# Altium schematic sheet Power.SchDoc
size A4
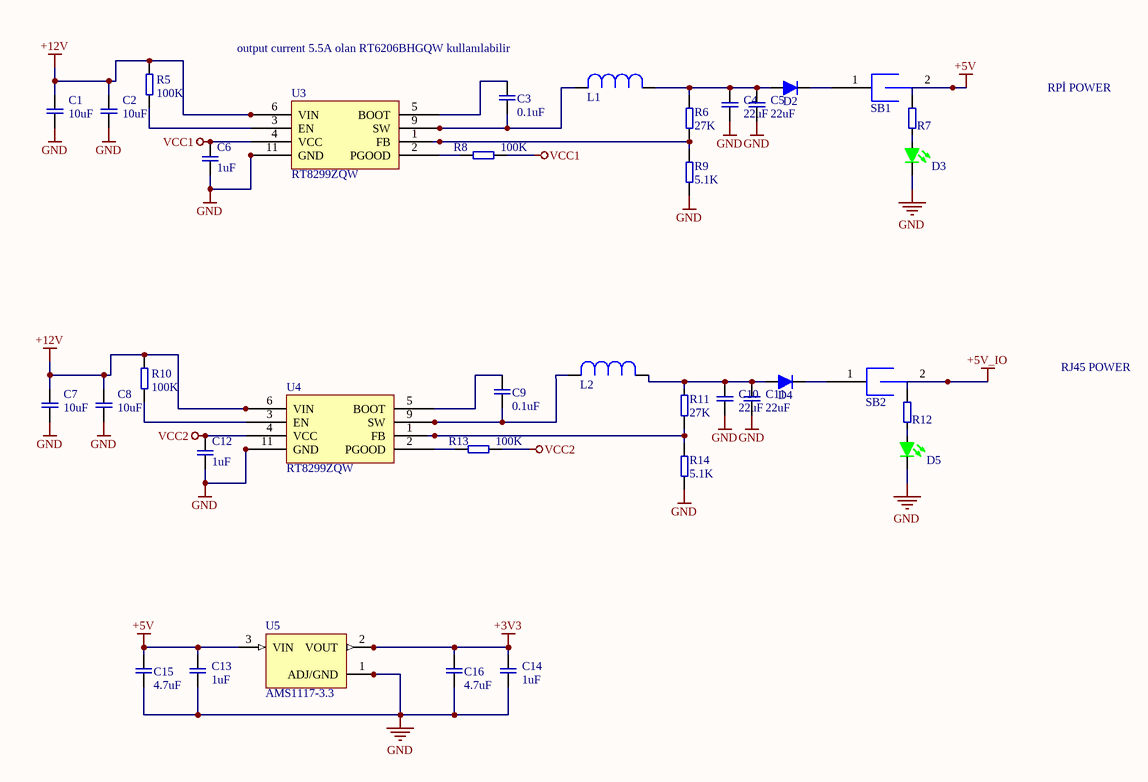
[diagram p0: Power.SchDoc]

## Parts
C1  10uF  [C0805]
C2  10uF  [C0805]
C3  0.1uF  [C0402]
C4  22uF  [C1210]
C5  22uF  [C1210]
C6  1uF  [C0603]
C7  10uF  [C0805]
C8  10uF  [C0805]
C9  0.1uF  [C0402]
C10  22uF  [C1210]
C11  22uF  [C1210]
C12  1uF  [C0603]
C13  1uF  [C0402]
C14  1uF  [C0402]
C15  4.7uF  [C0402]
C16  4.7uF  [C0402]
D2  TSSA3U60 R3G  [TAIWAN_TSSA3U60 R3G]  (value not drawn)
D3  SML-LX0603GW-TR  [L0603]  (value not drawn)
D4  TSSA3U60 R3G  [TAIWAN_TSSA3U60 R3G]  (value not drawn)
D5  SML-LX0603GW-TR  [L0603]  (value not drawn)
L1  XAL6060-682MEB  [CC_XAL6060-682MEB]  (value not drawn)
L2  XAL6060-682MEB  [CC_XAL6060-682MEB]  (value not drawn)
R5  100K  [R0402]
R6  27K  [R0402]
R7  330R  [R0603]  (value not drawn)
R8  100K  [R0402]
R9  5.1K  [R0402]
R10  100K  [R0402]
R11  27K  [R0402]
R12  330R  [R0603]  (value not drawn)
R13  100K  [R0402]
R14  5.1K  [R0402]
SB1  Jumper  [SB.0805]  (value not drawn)
SB2  Jumper  [SB.0805]  (value not drawn)
U3  RT8299ZQW  [RT8299ZQW]
U4  RT8299ZQW  [RT8299ZQW]
U5  AMS1117-3.3  [AMS1117-3.3]

## Nets
+3V3: C14.2 C16.2 U5.2(VOUT)
+5V: C13.2 C15.2 R7.2 SB1.2 U5.3(VIN)
+5V_IO: R12.2 SB2.2
+12V: C1.1 C2.1 C7.1 C8.1 R5.2 R10.2 U3.6(VIN) U3.7(VIN) U4.6(VIN) U4.7(VIN)
GND: C1.2 C2.2 C4.1 C5.1 C6.1 C7.2 C8.2 C10.1 C11.1 C12.1 C13.1 C14.1 C15.1 C16.1 D3.C D5.C R9.2 R14.2 U3.10(GND) U3.11(GND) U4.10(GND) U4.11(GND) U5.1(ADJ/GND)
VCC1: C6.2 R8.1 U3.4(VCC)
VCC2: C12.2 R13.1 U4.4(VCC)
NetC3_1: C3.1 L1.2 U3.8(SW) U3.9(SW)
NetC3_2: C3.2 U3.5(BOOT)
NetC4_2: C4.2 C5.2 D2.A L1.1 R6.2
NetC9_1: C9.1 L2.2 U4.8(SW) U4.9(SW)
NetC9_2: C9.2 U4.5(BOOT)
NetC10_2: C10.2 C11.2 D4.A L2.1 R11.2
NetD2_C: D2.C SB1.1
NetD3_A: D3.A R7.1
NetD4_C: D4.C SB2.1
NetD5_A: D5.A R12.1
NetR5_1: R5.1 U3.3(EN)
NetR6_1: R6.1 R9.1 U3.1(FB)
NetR8_2: R8.2 U3.2(PGOOD)
NetR10_1: R10.1 U4.3(EN)
NetR11_1: R11.1 R14.1 U4.1(FB)
NetR13_2: R13.2 U4.2(PGOOD)

## Notes on the sheet
- output current 5.5A olan RT6206BHGQW kullanılabilir
- RPİ POWER
- RJ45 POWER

## Library data of the parts
C1 C2 C7 C8 = CC0805KKX5R8BB106: CAP CER 10UF 25V X5R 0805; Manufacturer: YAGEO; Que: 074; Tolerance: ±10%; Type: Ceramic; Name: Recep Aydin; Part Number: CC0805KKX5R8BB106; Voltage: 25V; Temperature Coefficient: X5R; Package: 0805(2012 Metric); Datasheet: https://www.yageo.com/upload/media/product/productsearch/datasheet/mlcc/UPY-GPHC_X5R_4V-to-50V_26.pdf; Manufacturer Part Number: CC0805KKX5R8BB106
C3 C9 = 04023C104KAT2A: CAP CER 0.1UF 25V X7R 0402; Manufacturer: AVX Corporation; Que: 009; Tolerance: ±10%; Type: Ceramic; Name: Recep Aydin; Part Number: 04023C104KAT2A; Voltage: 25V; Temperature Coefficient: X7R; Package: 0402(1005 Metric); Datasheet: https://datasheets.avx.com/X7RDielectric.pdf; Manufacturer Part Number: 04023C104KAT2A
C4 C5 C10 C11 = CL32A226KAJNNWE: CAP CER 22UF 25V X5R 1210; Manufacturer: Samsung Electro-Mechanics; Que: 018; Tolerance: ±10%; Type: Ceramic; Name: Recep Aydin; Part Number: CL32A226KAJNNWE; Voltage: 25V; Temperature Coefficient: X5R; Package: 1210(3225 Metric); Datasheet: https://www.samsungsem.com/kr/support/product-search/mlcc/CL32A226KAJNNWE.jsp; Manufacturer Part Number: CL32A226KAJNNWE
C6 C12 = CGA3E1X7R1E105M080AC: CAP CER 1UF 25V X7R 0603; Manufacturer: TDK Corporation; Que: 017; Tolerance: ±20%; Type: Ceramic; Name: Recep Aydin; Part Number: CGA3E1X7R1E105M080AC; Voltage: 25V; Temperature Coefficient: X7R; Package: 0603(1608 Metric); Datasheet: https://product.tdk.com/en/system/files?file=dam/doc/product/capacitor/ceramic/mlcc/catalog/mlcc_automotive_general_en.pdf; Manufacturer Part Number: CGA3E1X7R1E105M080AC
C13 C14 = CL05A105KO5NNNC: CAP CER 1UF 16V X5R 0402; Manufacturer: Samsung Electro-Mechanics; Que: 077; Tolerance: ±10%; Type: Ceramic; Name: Recep Aydin; Part Number: CL05A105KO5NNNC; Voltage: 16V; Temperature Coefficient: X5R; Package: 0402(1005 Metric); Datasheet: https://media.digikey.com/pdf/Data%20Sheets/Samsung%20PDFs/CL05A105KO5NNNC_Spec_5-2-19.pdf; Manufacturer Part Number: CL05A105KO5NNNC
C15 C16 = C1005X5R1A475K050BC: CAP CER 4.7UF 10V X5R 0402; Manufacturer: TDK Corporation; Que: 021; Tolerance: ±10%; Type: Ceramic; Name: Recep Aydin; Part Number: C1005X5R1A475K050BC; Voltage: 10V; Temperature Coefficient: X5R; Package: 0402(1005 Metric); Datasheet: https://product.tdk.com/en/system/files?file=dam/doc/product/capacitor/ceramic/mlcc/catalog/mlcc_commercial_general_en.pdf; Manufacturer Part Number: C1005X5R1A475K050BC
D2 D4 = TSSA3U60 R3G: DIODE SCHOTTKY 60V 3A DO214AC; Manufacturer: Taiwan Semiconductor Corporation; Que: 003; Speed: Fast Recovery =< 500ns, > 200mA (Io); Name: Recep Aydin; Part Number: TSSA3U60 R3G; Diode Type: Schottky; Current: 3A; Package: DO-214AC; Datasheet: https://www.taiwansemi.com/assets/uploads/datasheet/TSSA3U60_F1612.pdf; Manufacturer Part Number: TSSA3U60 R3G
D3 D5 = SML-LX0603GW-TR: LED GREEN DIFFUSED SMD; Manufacturer: Lumex Opto/Components Inc.; Que: 001; Forward Voltage: 2.2V; Current: 20mA; Name: Recep Aydin; Part Number: SML-LX0603GW-TR; LensTransparency: Diffused; Color: Green; Package: 0603(1608 Metric); Datasheet: https://www.lumex.com/datasheet/SML-LX0603GW-TR; Manufacturer Part Number: SML-LX0603GW-TR
L1 L2 = XAL6060-682MEB: 6.8uH 9A 20.8mOhm Inductor; Manufacturer: Coilcraft; Que: 003; Filter Type: Molded; Name: Recep Aydin; Part Number: XAL6060-682MEB; Current Rating: 9 A; DC Resistance: 20.8 mOhm; Package: PINDC; Datasheet: https://www.mouser.com.tr/datasheet/2/597/xal60xx-270658.pdf; Manufacturer Part Number: XAL6060-682MEB
R5 R8 R10 R13 = RC0402FR-07100KL: RES SMD 100K OHM 1% 1/16W 0402; Manufacturer: YAGEO; Que: 055; Name: Recep Aydin; Part Number: RC0402FR-07100KL; Tolerance: 1%; Resistor Type: Thick Film; Package: 0402; Datasheet: https://www.yageo.com/upload/media/product/productsearch/datasheet/rchip/PYu-RC_Group_51_RoHS_L_11.pdf; Manufacturer Part Number: RC0402FR-07100KL
R6 R11 = RMCF0402FT27K0: RES 27K OHM 1% 1/16W 0402; Manufacturer: Stackpole Electronics Inc; Que: 142; Name: Ahmet Kemal Ayyildiz; Part Number: RMCF0402FT27K0; Tolerance: ±1%; Resistor Type: Thick Film; Package: 0402; Datasheet: https://www.seielect.com/catalog/sei-rmcf_rmcp.pdf; Manufacturer Part Number: RMCF0402FT27K0
R7 R12 = RMCF0603FT330R: RES 330 OHM 1% 1/10W 0603; Manufacturer: Stackpole Electronics Inc; Que: 002; Tolerance: 0.1%; Name: Recep Aydin; Part Number: RMCF0603FT330R; Resistor Type: Thick Film; Package: 0603; Datasheet: https://www.seielect.com/catalog/sei-rmcf_rmcp.pdf; Manufacturer Part Number: RMCF0603FT330R
R9 R14 = RC0402FR-075K1L: RES 5.1K OHM 1% 1/16W 0402; Manufacturer: YAGEO; Que: 089; Name: Recep Aydin; Part Number: RC0402FR-075K1L; Tolerance: 1%; Resistor Type: Thick Film; Package: 0402; Datasheet: https://www.yageo.com/upload/media/product/productsearch/datasheet/rchip/PYu-RC_Group_51_RoHS_L_11.pdf; Manufacturer Part Number: RC0402FR-075K1L
SB1 SB2 = Solder Bridge0805: 0805 Solder Bridge; Que: 006; Name: Recep Aydin; Part Number: Solder Bridge0805
U3 U4 = RT8299ZQW: IC REG BUCK ADJUSTABLE 3A 10WDFN; Manufacturer: Richtek USA Inc.; Que: 025; VoltageIN: 3V-24V; VoltageOUT: 0.8V-15V; Name: Ahmet Kemal Ayyildiz; Part Number: RT8299ZQW; Type: Buck; Package: 10-WFDFN Exposed Pad; Datasheet: https://www.richtek.com/assets/product_file/RT8299/DS8299-05.pdf; Manufacturer Part Number: RT8299ZQW
U5 = AMS1117-3.3: IC-1117 V.REG. 1A 3V3 SOT223 SMD AMS; Que: 021; VoltageIN: 4.8V; VoltageOUT: 3.3V; Name: Ahmet Kemal Ayyildiz; Part Number: AMS1117-3.3; Type: Positive Fixed; Package: SOT223; Datasheet: https://cdn.ozdisan.com/ETicaret_Dosya/348307_6210366.pdf; Manufacturer: AMS; Manufacturer Part Number: AMS1117-3.3